# Altium project BRZ_BATT_MANAGER.PrjPcb
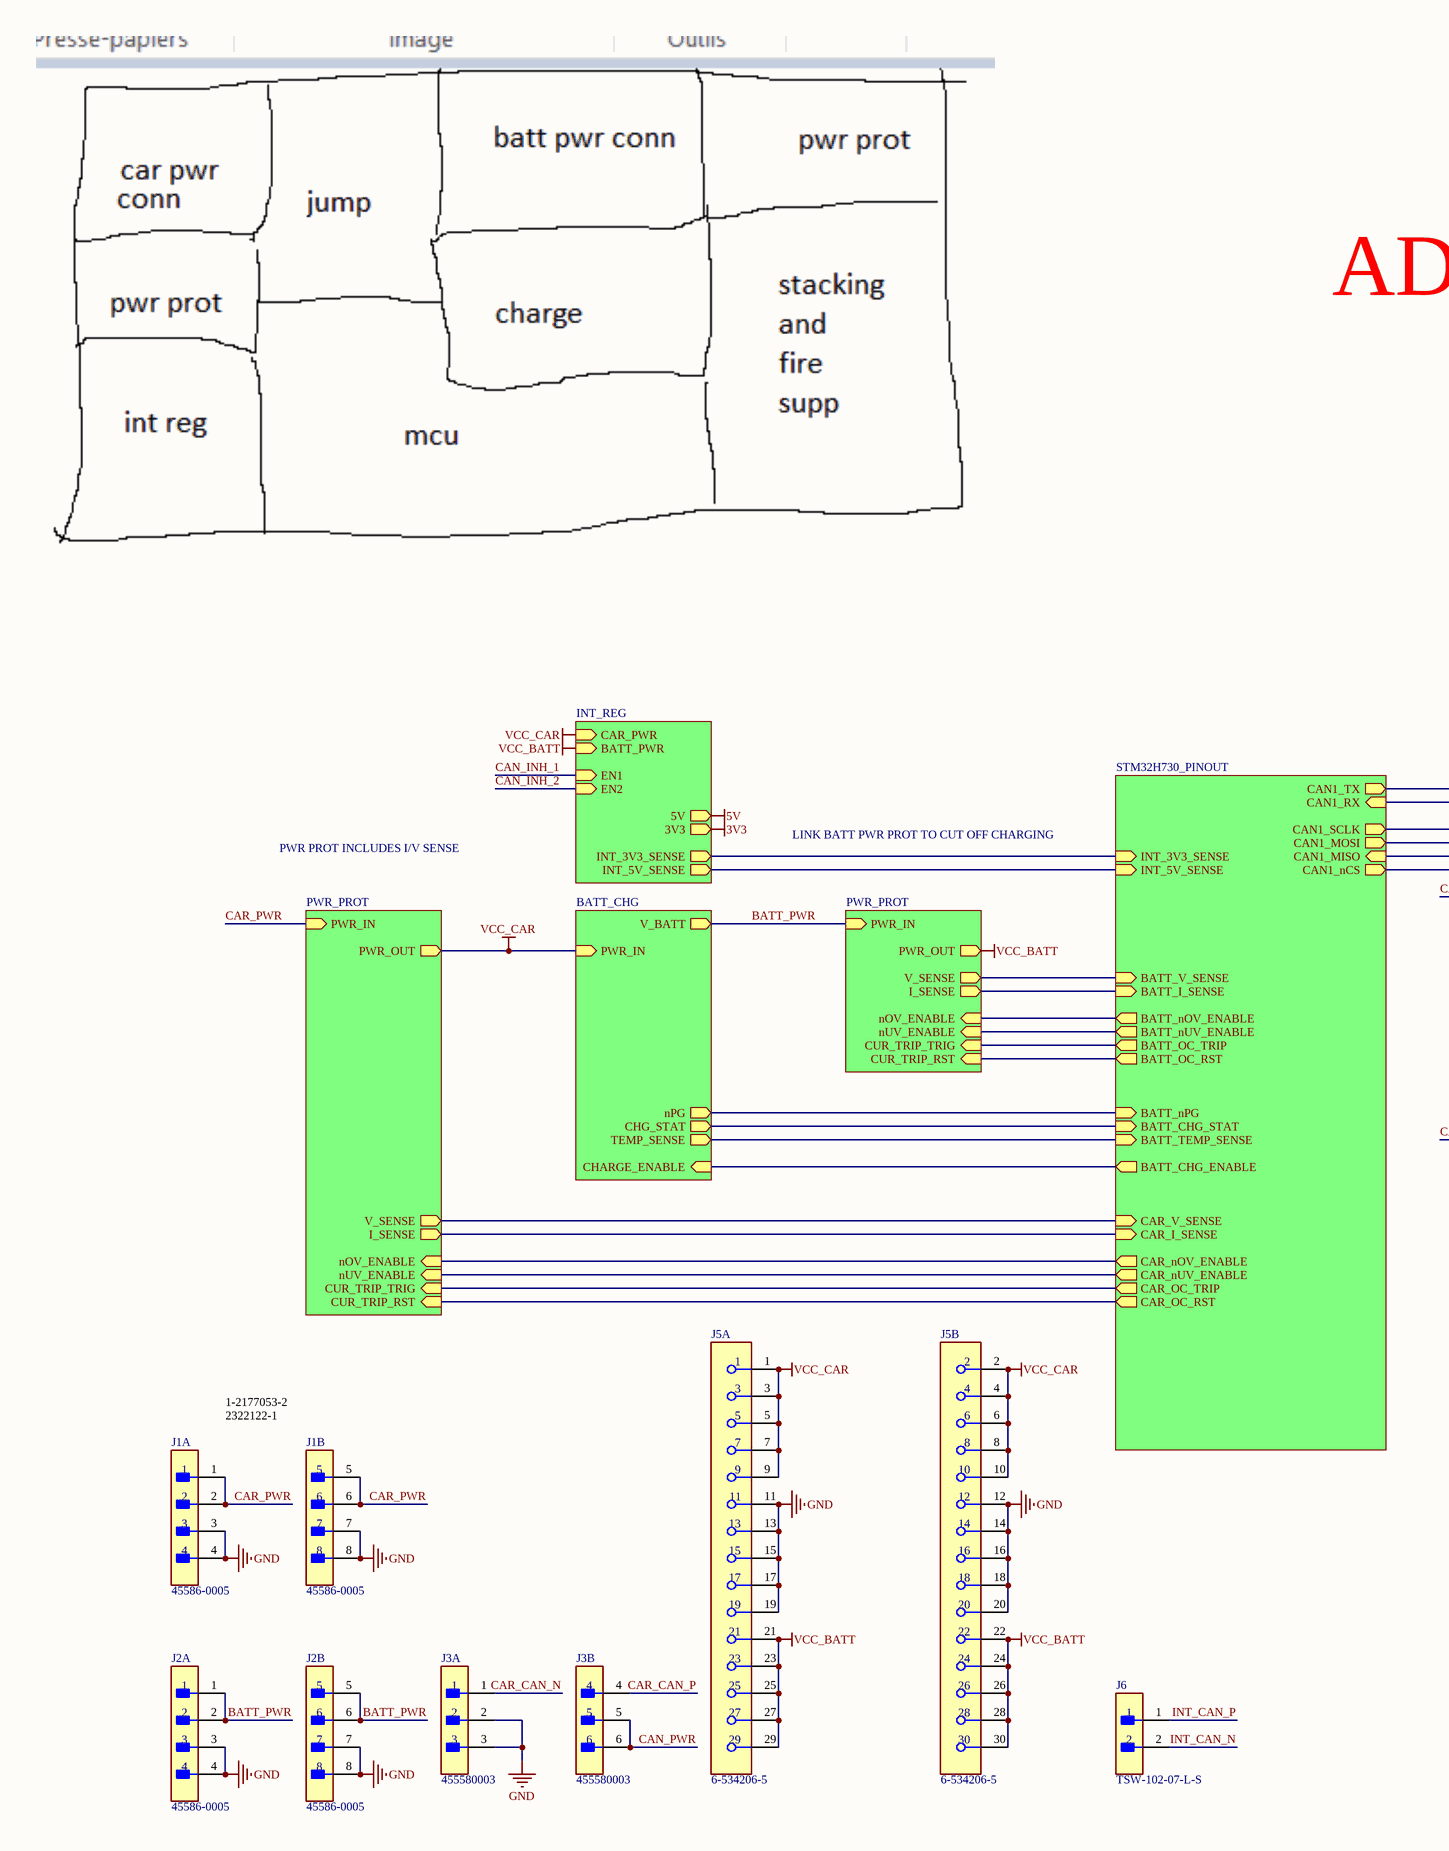
[diagram p0: BRZ_BATT_MGR.SchDoc, left]
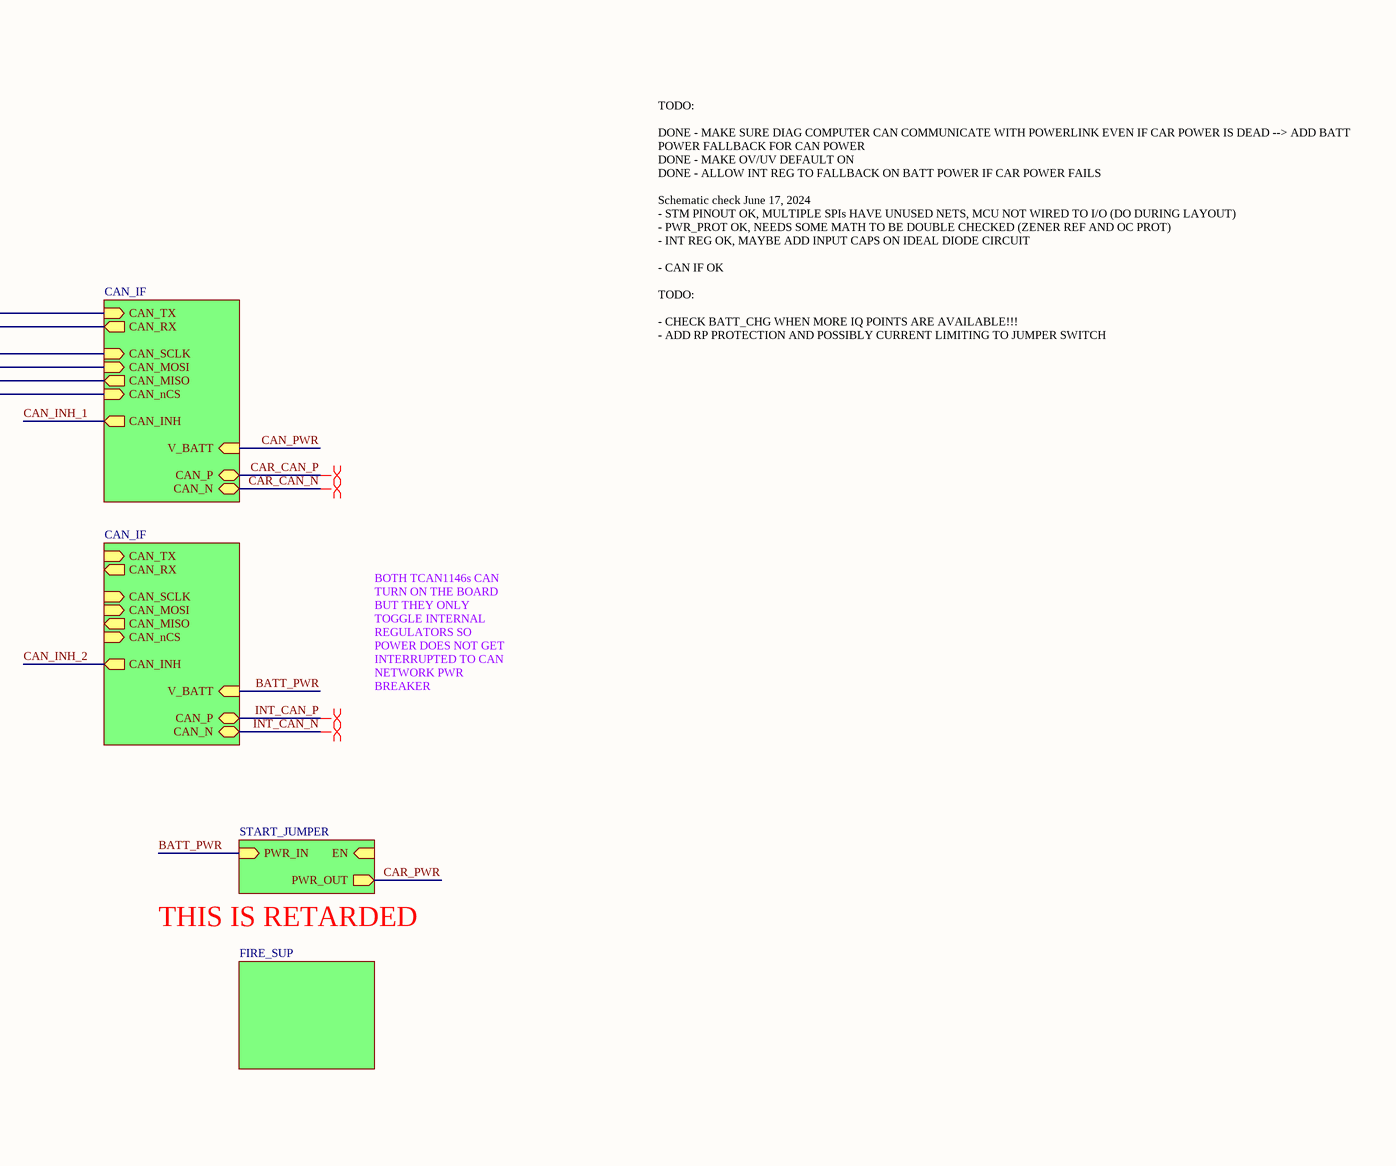
[diagram p1: BRZ_BATT_MGR.SchDoc, right]
2 sheets, 121 parts. Net scope: hierarchical (ports join the sheet entries above them; power ports are global).
Board file: BRZ_BATT_MANAGER.PcbDoc
Sheets:
  BRZ_BATT_MGR.SchDoc
    PWR_PROT_0 = PWR_PROT.SchDoc
    PWR_PROT_2 = PWR_PROT.SchDoc

## Sheet BRZ_BATT_MGR.SchDoc
size C; SheetNumber: 1; SheetTotal: 8

### Parts
J1  45586-0005  [FP-45586-0005-MFG]  (parts A,B of 2)
J2  45586-0005  [FP-45586-0005-MFG]  (parts A,B of 2)
J3  455580003  [FP-455580003-MFG]  (parts A,B of 2)
J5  6-534206-5  [FP-6-534206-5-MFG]  (parts A,B of 2)
J6  TSW-102-07-L-S  [FP-TSW-102-07-L-S-MFG]

### Sub-sheets
BATT_CHG = BATT_CHG (file not in this document): PWR_IN (in), V_BATT (out), nPG (out), CHG_STAT (out), TEMP_SENSE (out), CHARGE_ENABLE (in)
CAN_IF_0 = CAN_IF (file not in this document): CAN_TX (in), CAN_RX (out), CAN_SCLK (in), CAN_MISO (out), CAN_MOSI (in), CAN_nCS (in), V_BATT (in), CAN_INH (out), CAN_P (bidir), CAN_N (bidir)
CAN_IF_1 = CAN_IF (file not in this document): CAN_TX (in), CAN_RX (out), CAN_SCLK (in), CAN_MISO (out), CAN_MOSI (in), CAN_nCS (in), CAN_P (bidir), CAN_N (bidir), V_BATT (in), CAN_INH (out)
FIRE_SUP = FIRE_SUP (file not in this document): no entries
INT_REG = INT_REG (file not in this document): INT_3V3_SENSE (out), INT_5V_SENSE (out), 5V (out), 3V3 (out), EN1 (in), EN2 (in), CAR_PWR (in), BATT_PWR (in)
MCU = STM32H730_PINOUT (file not in this document): INT_3V3_SENSE (in), INT_5V_SENSE (in), BATT_V_SENSE (in), BATT_I_SENSE (in), BATT_nOV_ENABLE (out), BATT_nUV_ENABLE (out), BATT_OC_TRIP (out), BATT_OC_RST (out), BATT_nPG (in), BATT_CHG_STAT (in), BATT_TEMP_SENSE (in), BATT_CHG_ENABLE (out), CAR_V_SENSE (in), CAR_I_SENSE (in), CAR_nOV_ENABLE (out), CAR_nUV_ENABLE (out), CAR_OC_TRIP (out), CAR_OC_RST (out), CAN1_TX (out), CAN1_RX (in), CAN1_SCLK (out), CAN1_MOSI (out), CAN1_MISO (in), CAN1_nCS (out)
PWR_PROT_0 = PWR_PROT: PWR_OUT (out), PWR_IN (in), V_SENSE (out), I_SENSE (out), CUR_TRIP_RST (in), CUR_TRIP_TRIG (in), nOV_ENABLE (in), nUV_ENABLE (in)
PWR_PROT_2 = PWR_PROT: PWR_OUT (out), PWR_IN (in), V_SENSE (out), I_SENSE (out), CUR_TRIP_TRIG (in), CUR_TRIP_RST (in), nOV_ENABLE (in), nUV_ENABLE (in)
START_JUMPER = START_JUMPER (file not in this document): PWR_IN (in), PWR_OUT (out), EN (in)

### Nets
3V3: sheet INT_REG/3V3
5V: sheet INT_REG/5V
GND: J1.3 J1.4 J1.7 J1.8 J2.3 J2.4 J2.7 J2.8 J3.2 J3.3 J5.11 J5.12 J5.13 J5.14 J5.15 J5.16 J5.17 J5.18 J5.19 J5.20
VCC_BATT: J5.21 J5.22 J5.23 J5.24 J5.25 J5.26 J5.27 J5.28 J5.29 J5.30 ; sheet INT_REG/BATT_PWR, sheet PWR_PROT_2/PWR_OUT  [project net PWR_OUT]
VCC_CAR: J5.1 J5.2 J5.3 J5.4 J5.5 J5.6 J5.7 J5.8 J5.9 J5.10 ; sheet PWR_PROT_0/PWR_OUT, sheet INT_REG/CAR_PWR, sheet BATT_CHG/PWR_IN  [project net PWR_OUT]
BATT_PWR: J2.1 J2.2 J2.5 J2.6 ; sheet BATT_CHG/V_BATT, sheet PWR_PROT_2/PWR_IN, sheet CAN_IF_1/V_BATT, sheet START_JUMPER/PWR_IN
CAN_INH_1: sheet INT_REG/EN1, sheet CAN_IF_0/CAN_INH
CAN_INH_2: sheet INT_REG/EN2, sheet CAN_IF_1/CAN_INH
CAN_PWR: J3.5 J3.6 ; sheet CAN_IF_0/V_BATT
CAR_CAN_N: J3.1 ; sheet CAN_IF_0/CAN_N
CAR_CAN_P: J3.4 ; sheet CAN_IF_0/CAN_P
CAR_PWR: J1.1 J1.2 J1.5 J1.6 ; sheet PWR_PROT_0/PWR_IN, sheet START_JUMPER/PWR_OUT
CUR_TRIP_RST_PWR_PROT_0: sheet PWR_PROT_0/CUR_TRIP_RST, sheet MCU/CAR_OC_RST
CUR_TRIP_RST_PWR_PROT_2: sheet MCU/BATT_OC_RST, sheet PWR_PROT_2/CUR_TRIP_RST
CUR_TRIP_TRIG_PWR_PROT_0: sheet PWR_PROT_0/CUR_TRIP_TRIG, sheet MCU/CAR_OC_TRIP
CUR_TRIP_TRIG_PWR_PROT_2: sheet MCU/BATT_OC_TRIP, sheet PWR_PROT_2/CUR_TRIP_TRIG
I_SENSE_PWR_PROT_0: sheet PWR_PROT_0/I_SENSE, sheet MCU/CAR_I_SENSE
I_SENSE_PWR_PROT_2: sheet MCU/BATT_I_SENSE, sheet PWR_PROT_2/I_SENSE
INT_CAN_N: J6.2 ; sheet CAN_IF_1/CAN_N
INT_CAN_P: J6.1 ; sheet CAN_IF_1/CAN_P
V_SENSE_PWR_PROT_0: sheet PWR_PROT_0/V_SENSE, sheet MCU/CAR_V_SENSE
V_SENSE_PWR_PROT_2: sheet MCU/BATT_V_SENSE, sheet PWR_PROT_2/V_SENSE
NetR36_PWR_PROT_0_1: sheet PWR_PROT_0/nUV_ENABLE, sheet MCU/CAR_nUV_ENABLE
NetR36_PWR_PROT_2_1: sheet MCU/BATT_nUV_ENABLE, sheet PWR_PROT_2/nUV_ENABLE
NetR42_PWR_PROT_0_1: sheet PWR_PROT_0/nOV_ENABLE, sheet MCU/CAR_nOV_ENABLE
NetR42_PWR_PROT_2_1: sheet MCU/BATT_nOV_ENABLE, sheet PWR_PROT_2/nOV_ENABLE
(unnamed): sheet INT_REG/INT_3V3_SENSE, sheet MCU/INT_3V3_SENSE
(unnamed): sheet INT_REG/INT_5V_SENSE, sheet MCU/INT_5V_SENSE
(unnamed): sheet BATT_CHG/nPG, sheet MCU/BATT_nPG
(unnamed): sheet BATT_CHG/CHG_STAT, sheet MCU/BATT_CHG_STAT
(unnamed): sheet BATT_CHG/TEMP_SENSE, sheet MCU/BATT_TEMP_SENSE
(unnamed): sheet BATT_CHG/CHARGE_ENABLE, sheet MCU/BATT_CHG_ENABLE
(unnamed): sheet MCU/CAN1_TX, sheet CAN_IF_0/CAN_TX
(unnamed): sheet MCU/CAN1_RX, sheet CAN_IF_0/CAN_RX
(unnamed): sheet MCU/CAN1_SCLK, sheet CAN_IF_0/CAN_SCLK
(unnamed): sheet MCU/CAN1_MOSI, sheet CAN_IF_0/CAN_MOSI
(unnamed): sheet MCU/CAN1_MISO, sheet CAN_IF_0/CAN_MISO
(unnamed): sheet MCU/CAN1_nCS, sheet CAN_IF_0/CAN_nCS

### Layout directives
differential pair: CAR_CAN_N, CAR_CAN_P, INT_CAN_N, INT_CAN_P

### Notes on the sheet
- ADD A PDU HERE
- PWR PROT INCLUDES I/V SENSE
- LINK BATT PWR PROT TO CUT OFF CHARGING
- TODO:
  DONE - MAKE SURE DIAG COMPUTER CAN COMMUNICATE WITH POWERLINK EVEN IF CAR POWER IS DEAD --> ADD BATT POWER FALLBACK FOR CAN POWER
  DONE - MAKE OV/UV DEFAULT ON
  DONE - ALLOW INT REG TO FALLBACK ON BATT POWER IF CAR POWER FAILS
  Schematic check June 17, 2024
  - STM PINOUT OK, MULTIPLE SPIs HAVE UNUSED NETS, MCU NOT WIRED TO I/O (DO DURING LAYOUT)
  - PWR_PROT OK, NEEDS SOME MATH TO BE DOUBLE CHECKED (ZENER REF AND OC PROT)
  - INT REG OK, MAYBE ADD INPUT CAPS ON IDEAL DIODE CIRCUIT
  - CAN IF OK
  TODO:
  - CHECK BATT_CHG WHEN MORE IQ POINTS ARE AVAILABLE!!!
  - ADD RP PROTECTION AND POSSIBLY CURRENT LIMITING TO JUMPER SWITCH
- BOTH TCAN1146s CAN TURN ON THE BOARD BUT THEY ONLY TOGGLE INTERNAL REGULATORS SO POWER DOES NOT GET INTERRUPTED TO CAN NETWORK PWR BREAKER
- THIS IS RETARDED
- 1-2177053-2
  2322122-1

### Library data of the parts
J1 J2 = CMP-04776-000690-1: CONN HEADER R/A 8POS 4.2MM
J3 = CMP-04776-000024-1: CONN HEADER R/A 6POS 4.2MM; Manufacturer: Molex; Standoff Height: 0.4mm; Conn Orientation: Right Angle; Number Of Contacts: 6; Conn Gender: Male; Voltage Rating: 600V; Current Rating: 8A; Footprint Url: https://www.molex.com/pdm_docs/sd/455580003_sd.pdf; Number Of Rows: 2; Lead Free: Yes; Digikey Description: CONN HEADER R/A 6POS 4.2MM; ComponentLink2URL: https://www.molex.com/webdocs/datasheets/pdf/en-us/0455580003_PCB_HEADERS.pdf; Octopart: https://octopart.com/45558-0003-molex-7672845; Package: 0; Device Class L3: unset; ComponentLink2Description: Datasheet; Device Class L2: Headers and Wire Housings; Category: Conn; Contact Material: Tin,Nickel; Mouser Description: Conn Power HDR 6 POS 4.2mm Solder ST Thru-Hole 6 Terminal 1 Port Mini-Fit Jr™ Tray; Manufacturer Part Number: 455580003; Pitch: 4.2mm; Device Class L1: Connectors; Temperature Range Low: -40°C; Temperature: -40°C to +105°C; RoHS: TRUE; Temperature Range High: +105°C; Height: 10.38mm; Automotive: No
J5 = CMP-03369-000056-1: CONN RCPT 30POS 0.1 GOLD PCB; Manufacturer: TE; Number Of Contacts: 30; Is Female: yes; Pitch: 2.54mm; Conn Gender: Female; Standoff Height: 0.38mm; Conn Orientation: Vertical; Current Rating: 2A; Lead Free: Yes; Category: Conn; Mouser Description: Headers & Wire Housings REC 2X15P VRT T/H; Device Class L3: unset; Height: 8.9mm; ComponentLink2Description: Datasheet; Manufacturer Part Number: 6-534206-5; RoHS: TRUE; ComponentLink2URL: https://www.te.com/commerce/DocumentDelivery/DDEController?Action=showdoc&DocId=Specification+Or+Standard%7F114-25018%7FE%7Fpdf%7FEnglish%7FENG_SS_114-25018_E.pdf%7F6-534206-5; Temperature: -65°C to +105°C; Temperature Range Low: -65°C; Footprint Url: https://www.te.com/commerce/DocumentDelivery/DDEController?Action=showdoc&DocId=Customer+Drawing%7F534206%7FR7%7Fpdf%7FEnglish%7FENG_CD_534206_R7.pdf%7F6-534206-5; Contact Material: Gold,Nickel; Automotive: No; Package: 0; Device Class L2: Headers and Wire Housings; Device Class L1: Connectors; Temperature Range High: +105°C; Number Of Rows: 2; Digikey Description: CONN RCPT 30POS 0.1 GOLD PCB; Octopart: https://octopart.com/6-534206-5-te+connectivity-39516817
J6 = CMP-02766-001428-1: CONN HEADER VERT 2POS 2.54MM; Voltage Rating: 550V; Current Rating: 7.6A; Gender: Male; Number of Contacts: 2; Connector Type: Male Pin; Radiation Hardening: No; Orientation: Straight; Contact Plating: Gold; Max Operating Temperature: 125°C; Mount: Through Hole; Package Quantity: 1; Number of Rows: 1; Housing Material: Polyester; RoHS Compliant: Yes; Length: 5.08mm; Max Voltage Rating (AC): 550V; Pitch: 2.54mm; Packaging: Bulk; Depth: 2.54mm; Termination: Solder; Min Operating Temperature: -55°C; Housing Color: Black; Lead Free: Lead Free; Color: Black; Number of Positions: 2; Width: 2.54mm; Max Current Rating: 7.6A; REACH SVHC: No SVHC; Contact Material: Bronze; Contact Mating Length: 0.23inch; Series: TSW; Contact Type: Male Pin

## Sheet PWR_PROT.SchDoc
size C; SheetNumber: 3; SheetTotal: 8
Used 2 times, as channels PWR_PROT_0, PWR_PROT_2. Parts and nets are listed once, with the designators drawn on the sheet.
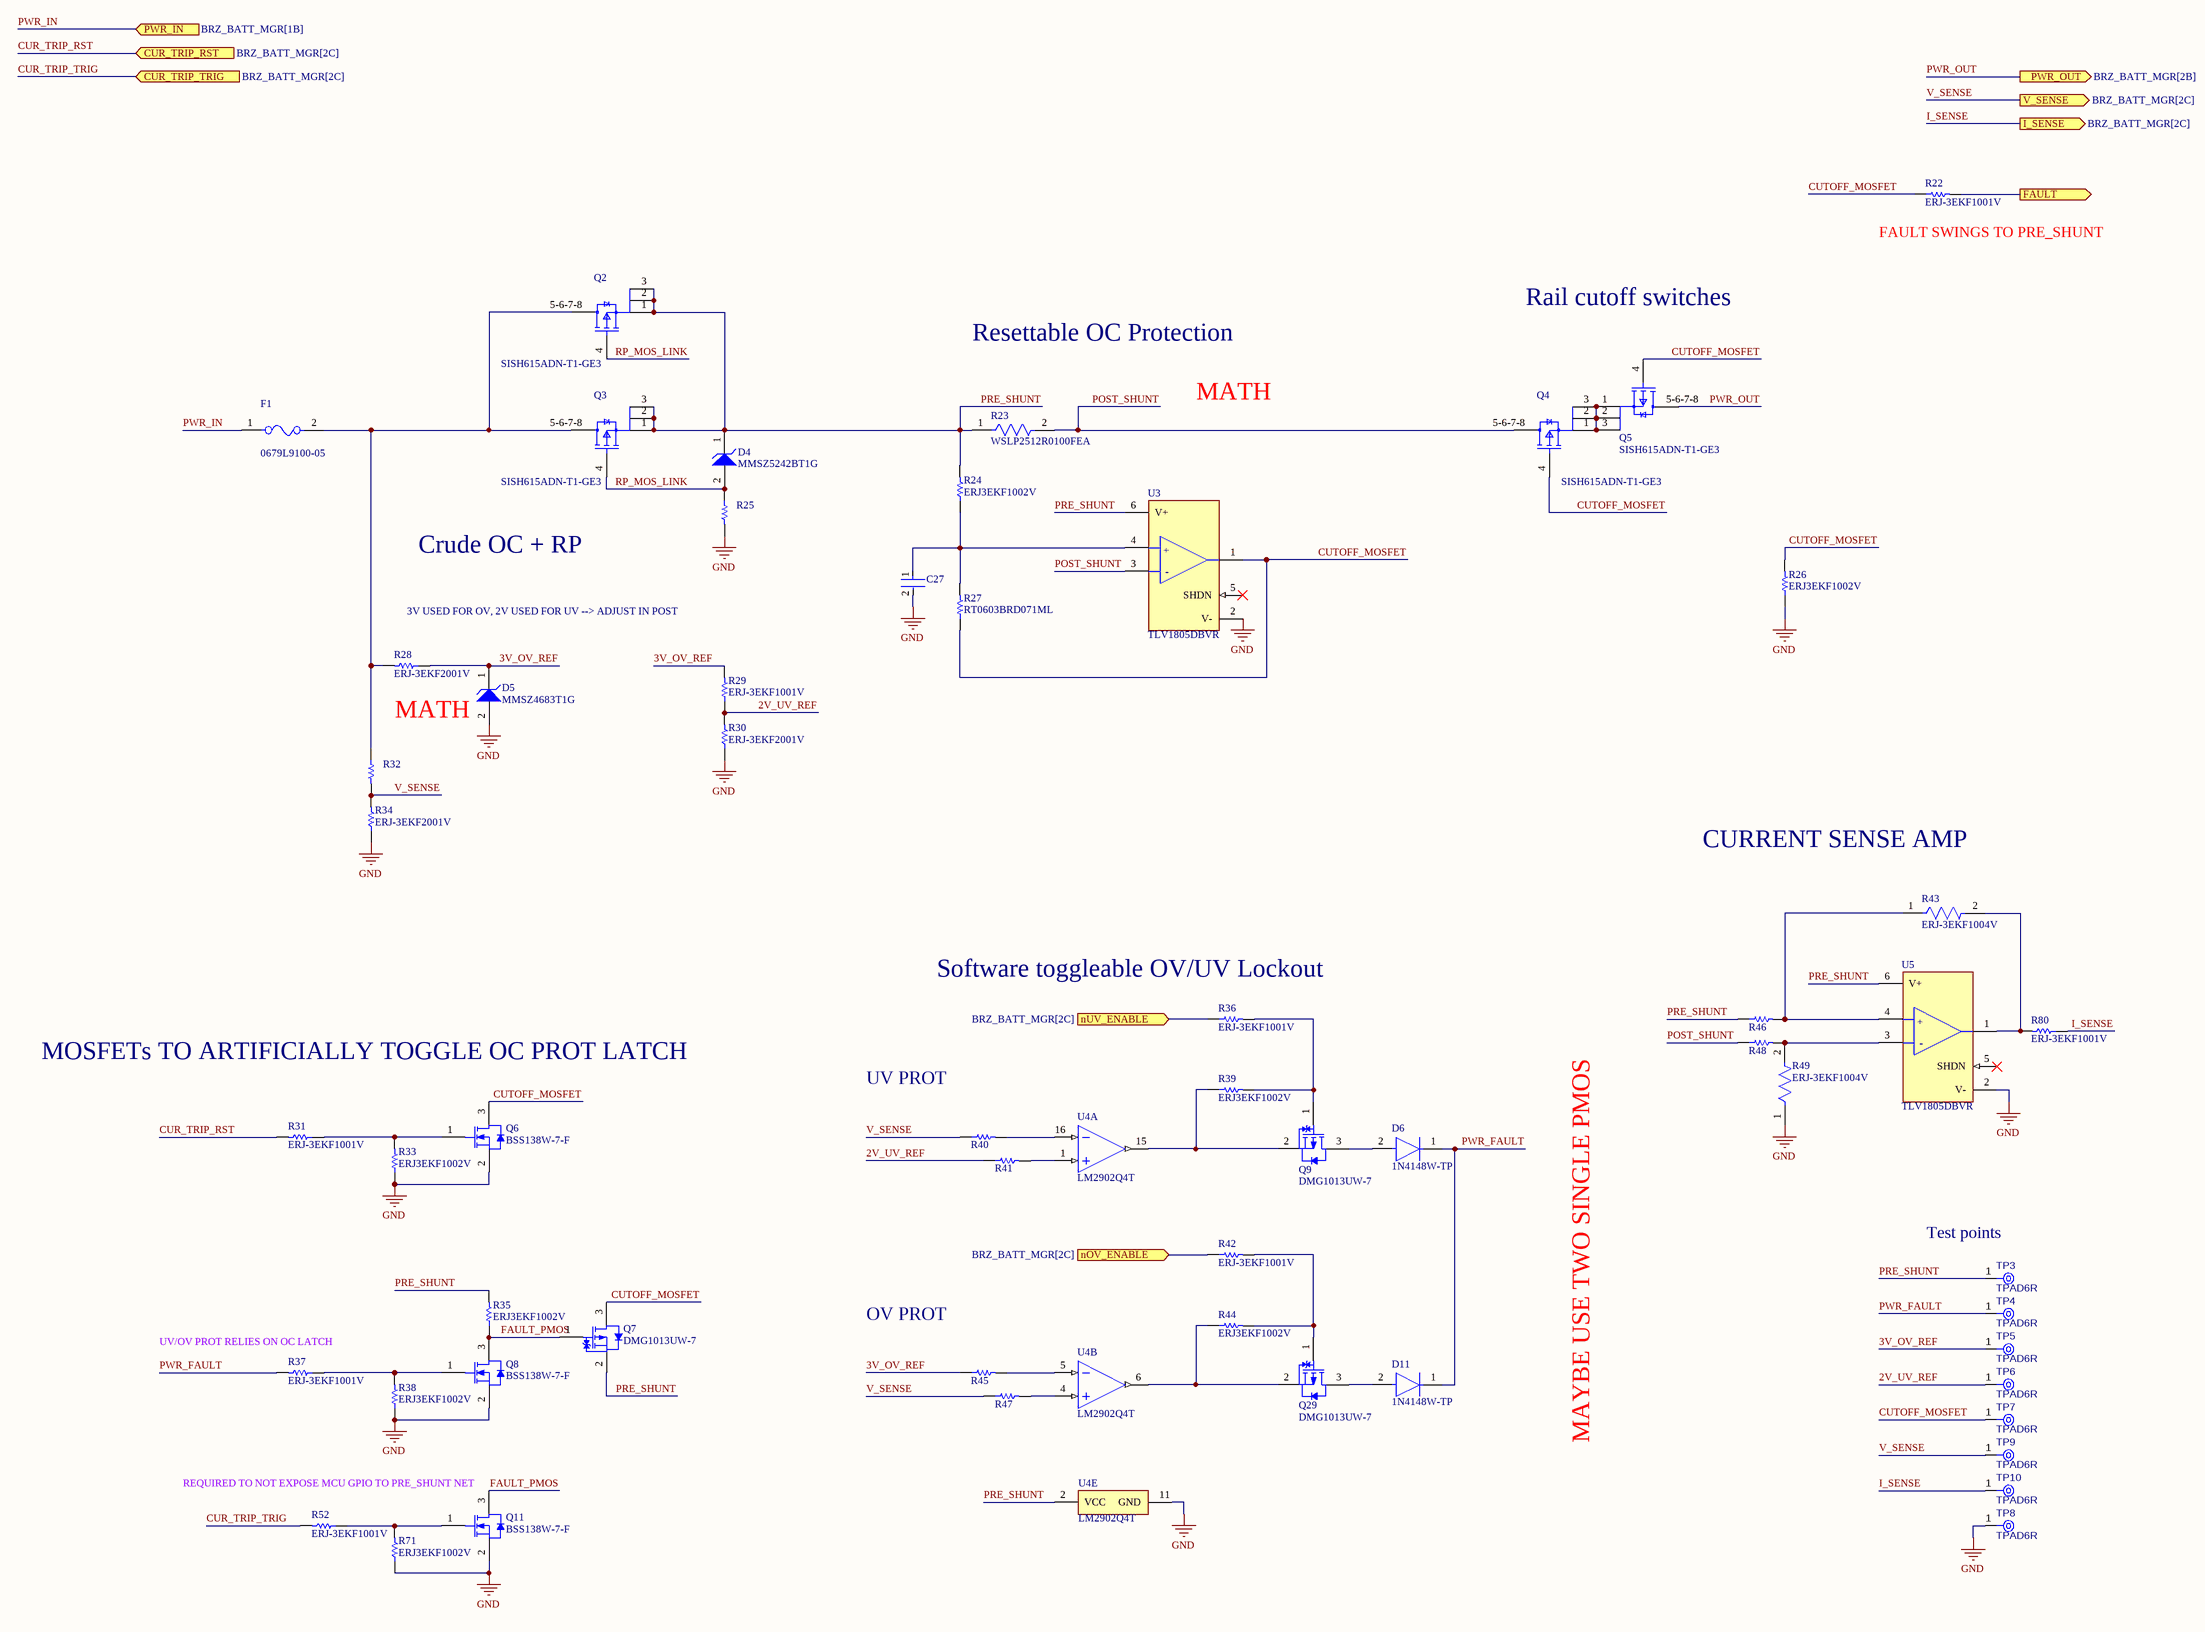
[diagram p2: PWR_PROT.SchDoc]

### Parts
C27  GRM188R71H104KA93D  [FP-0402-L_1_0_0_05-W_0_5-IPC_A]  (value not drawn)
D4  MMSZ5242BT1G  [ONSC-SOD-123-2-425-04_V]
D5  MMSZ4683T1G  [ONSC-SOD-123-2-425-04_V]
D6  1N4148W-TP  [FP-SOD-123-IPC_A]
D11  1N4148W-TP  [FP-SOD-123-IPC_A]
F1  0679L9100-05  [FP-0679L-MFG]
Q2  SISH615ADN-T1-GE3  [SISH615ADN-T1-GE3-Footprint-1]
Q3  SISH615ADN-T1-GE3  [SISH615ADN-T1-GE3-Footprint-1]
Q4  SISH615ADN-T1-GE3  [SISH615ADN-T1-GE3-Footprint-1]
Q5  SISH615ADN-T1-GE3  [SISH615ADN-T1-GE3-Footprint-1]
Q6  BSS138W-7-F  [DIOD-SOT323-3_V]
Q7  DMG1013UW-7  [DIOD-SOT323-3_V]
Q8  BSS138W-7-F  [DIOD-SOT323-3_V]
Q9  DMG1013UW-7  [DIOD-SOT323-3_V]
Q11  BSS138W-7-F  [DIOD-SOT323-3_V]
Q29  DMG1013UW-7  [DIOD-SOT323-3_V]
R22  ERJ-3EKF1001V  [RESC1608X55X30LL15T15]
R23  WSLP2512R0100FEA  [FP-WSLP2512R0100FEA-MFG]
R24  ERJ3EKF1002V  [RESC1609X55X30LL15T15]
R25  ERJ3EKF1002V  [RESC1609X55X30LL15T15]  (value not drawn)
R26  ERJ3EKF1002V  [RESC1609X55X30LL15T15]
R27  RT0603BRD071ML  [RESC1608X55X30NL20T20]
R28  ERJ-3EKF2001V  [RESC1608X55X30ML15T15]
R29  ERJ-3EKF1001V  [RESC1608X55X30LL15T15]
R30  ERJ-3EKF2001V  [RESC1608X55X30ML15T15]
R31  ERJ-3EKF1001V  [RESC1608X55X30LL15T15]
R32  ERJ3EKF1002V  [RESC1609X55X30LL15T15]  (value not drawn)
R33  ERJ3EKF1002V  [RESC1609X55X30LL15T15]
R34  ERJ-3EKF2001V  [RESC1608X55X30ML15T15]
R35  ERJ3EKF1002V  [RESC1609X55X30LL15T15]
R36  ERJ-3EKF1001V  [RESC1608X55X30LL15T15]
R37  ERJ-3EKF1001V  [RESC1608X55X30LL15T15]
R38  ERJ3EKF1002V  [RESC1609X55X30LL15T15]
R39  ERJ3EKF1002V  [RESC1609X55X30LL15T15]
R40  ERJ3EKF1002V  [RESC1609X55X30LL15T15]  (value not drawn)
R41  ERJ3EKF1002V  [RESC1609X55X30LL15T15]  (value not drawn)
R42  ERJ-3EKF1001V  [RESC1608X55X30LL15T15]
R43  ERJ-3EKF1004V  [FP-ERJ3EK-IPC_C]
R44  ERJ3EKF1002V  [RESC1609X55X30LL15T15]
R45  ERJ3EKF1002V  [RESC1609X55X30LL15T15]  (value not drawn)
R46  ERJ3EKF1002V  [RESC1609X55X30LL15T15]  (value not drawn)
R47  ERJ3EKF1002V  [RESC1609X55X30LL15T15]  (value not drawn)
R48  ERJ3EKF1002V  [RESC1609X55X30LL15T15]  (value not drawn)
R49  ERJ-3EKF1004V  [FP-ERJ3EK-IPC_C]
R52  ERJ-3EKF1001V  [RESC1608X55X30LL15T15]
R71  ERJ3EKF1002V  [RESC1609X55X30LL15T15]
R80  ERJ-3EKF1001V  [RESC1608X55X30LL15T15]
TP3  TPAD6R  [TP06R]  (no BOM)
TP4  TPAD6R  [TP06R]  (no BOM)
TP5  TPAD6R  [TP06R]  (no BOM)
TP6  TPAD6R  [TP06R]  (no BOM)
TP7  TPAD6R  [TP06R]  (no BOM)
TP8  TPAD6R  [TP06R]  (no BOM)
TP9  TPAD6R  [TP06R]  (no BOM)
TP10  TPAD6R  [TP06R]  (no BOM)
U3  TLV1805DBVR  [FP-DBV0006A-IPC_C]
U4  LM2902Q4T  [LM2902Q4T-Footprint-1]  (parts A,B,E of 5)
U5  TLV1805DBVR  [FP-DBV0006A-IPC_C]

### Ports
CUR_TRIP_RST (in, see BRZ_BATT_MGR[2C]), CUR_TRIP_TRIG (in, see BRZ_BATT_MGR[2C]), FAULT (out), I_SENSE (out, see BRZ_BATT_MGR[2C]), nOV_ENABLE (in, see BRZ_BATT_MGR[2C]), nUV_ENABLE (in, see BRZ_BATT_MGR[2C]), PWR_IN (in, see BRZ_BATT_MGR[1B]), PWR_OUT (out, see BRZ_BATT_MGR[2B]), V_SENSE (out, see BRZ_BATT_MGR[2C])

### Nets
GND: C27.2 D5.2(A) Q6.2(S) Q8.2(S) Q11.2(S) R25.2 R26.1 R30.1 R33.1 R34.1 R38.1 R49.1 R71.1 TP8.1(TP) U3.2(V-) U4.11(GND) U5.2(V-)
2V_UV_REF: R29.1 R30.2 R41.1 TP6.1(TP)
3V_OV_REF: D5.1(K) R28.1 R29.2 R45.1 TP5.1(TP)
CUR_TRIP_RST: R31.2 ; port CUR_TRIP_RST
CUR_TRIP_TRIG: R52.2 ; port CUR_TRIP_TRIG
CUTOFF_MOSFET: Q4.4(G) Q5.4(G) Q6.3(D) Q7.3(D) R22.1 R26.2 R27.1 TP7.1(TP) U3.1(OUT)
FAULT: R22.2 ; port FAULT
FAULT_PMOS: Q7.1(G) Q8.3(D) Q11.3(D) R35.1
I_SENSE: R80.1 TP10.1(TP) ; port I_SENSE
nOV_ENABLE: R42.1 ; port nOV_ENABLE
nUV_ENABLE: R36.1 ; port nUV_ENABLE
POST_SHUNT: Q4.5-6-7-8(D) R23.2 R48.1 U3.3(-IN)
PRE_SHUNT: D4.1(K) Q2.1(S) Q2.2(S) Q2.3(S) Q3.1(S) Q3.2(S) Q3.3(S) Q7.2(S) R23.1 R24.2 R35.2 R46.1 TP3.1(TP) U3.6(V+) U4.2(VCC) U5.6(V+)
PWR_FAULT: D6.1(C) D11.1(C) R37.2 TP4.1(TP)
PWR_IN: F1.1 ; port PWR_IN
PWR_OUT: Q5.5-6-7-8(D) ; port PWR_OUT
RP_MOS_LINK: D4.2(A) Q2.4(G) Q3.4(G) R25.1
V_SENSE: R32.2 R34.2 R40.1 R47.1 TP9.1(TP) ; port V_SENSE
NetC27_1: C27.1 R24.1 R27.2 U3.4(+IN)
NetD6_2: D6.2(A) Q9.3(D)
NetD11_2: D11.2(A) Q29.3(D)
NetF1_2: F1.2 Q2.5-6-7-8(D) Q3.5-6-7-8(D) R28.2 R32.1
NetQ4_1: Q4.1(S) Q4.2(S) Q4.3(S) Q5.1(S) Q5.2(S) Q5.3(S)
NetQ6_1: Q6.1(G) R31.1 R33.2
NetQ8_1: Q8.1(G) R37.1 R38.2
NetQ9_1: Q9.1(G) R36.2 R39.2
NetQ9_2: Q9.2(S) R39.1 U4.15(1OUT)
NetQ11_1: Q11.1(G) R52.1 R71.2
NetQ29_1: Q29.1(G) R42.2 R44.2
NetQ29_2: Q29.2(S) R44.1 U4.6(2OUT)
NetR40_2: R40.2 U4.16(1IN-)
NetR41_2: R41.2 U4.1(1IN+)
NetR43_1: R43.1 R46.2 U5.4(+IN)
NetR43_2: R43.2 R80.2 U5.1(OUT)
NetR45_2: R45.2 U4.5(2IN-)
NetR47_2: R47.2 U4.4(2IN+)
NetR48_2: R48.2 R49.2 U5.3(-IN)

Not connected (* = marked no-connect by the designer): U3 5(SHDN)*; U5 5(SHDN)*

### Channels
PWR_PROT_0: designators end in _PWR_PROT_0; ports CUR_TRIP_RST=CUR_TRIP_RST_PWR_PROT_0 CUR_TRIP_TRIG=CUR_TRIP_TRIG_PWR_PROT_0 FAULT=NetR22_PWR_PROT_0_2 I_SENSE=I_SENSE_PWR_PROT_0 nOV_ENABLE=NetR42_PWR_PROT_0_1 nUV_ENABLE=NetR36_PWR_PROT_0_1 PWR_IN=CAR_PWR PWR_OUT=PWR_OUT V_SENSE=V_SENSE_PWR_PROT_0
PWR_PROT_2: designators end in _PWR_PROT_2; ports CUR_TRIP_RST=CUR_TRIP_RST_PWR_PROT_2 CUR_TRIP_TRIG=CUR_TRIP_TRIG_PWR_PROT_2 FAULT=NetR22_PWR_PROT_2_2 I_SENSE=I_SENSE_PWR_PROT_2 nOV_ENABLE=NetR42_PWR_PROT_2_1 nUV_ENABLE=NetR36_PWR_PROT_2_1 PWR_IN=BATT_PWR PWR_OUT=PWR_OUT V_SENSE=V_SENSE_PWR_PROT_2

### Notes on the sheet
- (near R22) FAULT SWINGS TO PRE_SHUNT
- Rail cutoff switches
- Resettable OC Protection
- MATH
- Crude OC + RP
- 3V USED FOR OV, 2V USED FOR UV --> ADJUST IN POST
- CURRENT SENSE AMP
- (near R36) Software toggleable OV/UV Lockout
- MOSFETs TO ARTIFICIALLY TOGGLE OC PROT LATCH
- UV PROT
- (near TP3) Test points
- OV PROT
- (near R37) UV/OV PROT RELIES ON OC LATCH
- MAYBE USE TWO SINGLE PMOS
- REQUIRED TO NOT EXPOSE MCU GPIO TO PRE_SHUNT NET
- (in symbol CMP-04896-000098-1) +; -

### Library data of the parts
C27 = CMP-001-00058-1: LARGE PADS, 0402 CAP, CHANGE COMMENT TO MATCH REAL P/N; Capacitor Type: Ceramic; Min Operating Temperature: -55°C; Mounting Technology: Surface Mount; Pins: 2; Case/Package: 0402; RoHS Compliant: Yes; Max Operating Temperature: 85°C
D4 = CMP-1060-00565-1: Zener Voltage Regulator, 500 mW, 2-Pin SOD-123, Pb-Free, Tape and Reel; Manufacturer: On Semiconductor; P Max (W): 0.5; VZ Typ (V): 12; PartNumber: MMSZ5242BT1G; PackageReference: SOD-123-2-425-04; ComponentLink3URL: http://www.onsemi.com/pub_link/Collateral/425-04.PDF; Mounting Technology: Surface Mount; ComponentLink2Description: Datasheet; ComponentLink1URL: http://www.onsemi.com/; ComponentLink3Description: Package Specification; PackageDescription: 2-Pin SOD, Body 1.6 x 2.69 mm; PackageVersion: Rev. G, 10/2009; ComponentLink1Description: Manufacturer URL; RoHS: Pb-Free; ComponentLink2URL: http://www.onsemi.com/pub_link/Collateral/MMSZ5221BT1-D.PDF; Packing: Tape and Reel; DatasheetVersion: Rev. 12
D5 = CMP-1060-00600-1: Zener Voltage Regulator, 500 mW, 2-Pin SOD-123, Pb-Free, Tape and Reel; Manufacturer: On Semiconductor; P Max (W): 0.5; VZ Typ (V): 3; ComponentLink2Description: Datasheet; ComponentLink3URL: http://www.onsemi.com/pub_link/Collateral/425-04.PDF; PackageVersion: Rev. G, 10/2009; RoHS: Pb-Free; ComponentLink2URL: http://www.onsemi.com/pub_link/Collateral/MMSZ4678T1-D.PDF; DatasheetVersion: Rev. 9; PackageDescription: 2-Pin SOD, Body 1.6 x 2.69 mm; PartNumber: MMSZ4683T1G; ComponentLink3Description: Package Specification; ComponentLink1URL: http://www.onsemi.com/; ComponentLink1Description: Manufacturer URL; Packing: Tape and Reel; PackageReference: SOD-123-2-425-04; Mounting Technology: Surface Mount
D6 D11 = CMP-2000-04993-2: DIODE GEN PURP 100V 150MA SOD123; Max Reverse Leakage Current: 5uA; Max Surge Current: 2A; Reverse Recovery Time: 4ns; Polarity: Standard; Capacitance: 4pF; Max Forward Surge Current (Ifsm): 1A; Element Configuration: Single; Power Dissipation: 400mW; Forward Voltage: 1V; Radiation Hardening: No; Lead Free: Lead Free; Max Reverse Voltage (DC): 100V; Current Rating: 150mA; Forward Current: 150mA; Packaging: Tape and Reel; Number of Pins: 2; Package Quantity: 3000; Max Operating Temperature: 150°C; Min Operating Temperature: -65°C; Average Rectified Current: 150mA; Recovery Time: 4ns; Output Current: 150mA; Peak Non-Repetitive Surge Current: 2A; Width: 1.8mm; Voltage Rating (DC): 100V; Height: 1.2mm; Max Repetitive Reverse Voltage (Vrrm): 100V; Mount: Surface Mount; Length: 2.85mm
F1 = CMP-16042-000002-1: DIFF P#!!! / FUSE BRD MNT 10A 125VAC/VDC; Manufacturer: Bel Fuse; Manufacturer Part Number: 0679L9150-01; Max Fuse Ac Voltage: 125V; Fuse Blow Speed: Fast; Fuse Current: 15A; Fuse I2T: 103.5A2Sec; Fuse Interrupt Ac Current: 50A; Automotive Grade: Grade 1; Value: 0.0038Ω; Fuse Interrupt Dc Current: 300A; Fuse Voltage Drop: 0.13V; Device Class L2: Fuses; ComponentLink2URL: https://www.belfuse.com/resources/CircuitProtection/datasheets/0679L%20Sep2016.pdf; Package: 0679L; Height: 2.79mm; Digikey Description: FUSE BRD MNT 15A 125VAC/VDC; Temperature Range High: +125°C; Device Class L3: unset; Octopart: https://octopart.com/0679l9150-01-bel+fuse-70850665; Temperature Range Low: -55°C; Max Fuse Dc Voltage: 125V; Ipc Land Pattern Name: CAPC610254X254; Category: Fuse; Lead Free: Yes; Automotive: Yes; Resistance: 0.0038Ω; RoHS: TRUE; Device Class L1: Circuit Protection; ComponentLink2Description: Datasheet; Temperature: -55°C to +125°C; Voltage Rating: 125V
Q2 Q3 = CMP-013-00036-2: Trans MOSFET P-CH 20V 22.1A 8-Pin PowerPAK 1212 EP T/R
Q4 Q5 = CMP-013-00036-1: Trans MOSFET P-CH 20V 22.1A 8-Pin PowerPAK 1212 EP T/R
Q6 Q8 Q11 = CMP-2000-05968-1: N-Channel Enhancement Mode Mosfet, 50 V, 200 mA, -55 to 150 degC, 6-Pin SOT-323, RoHS, Tape and Reel; Typical Turn-Off Delay Time: 20ns; Number of Channels: 1Channel; Type: EnhancementModeFieldEffectTransistor; Brand: DiodesIncorporated; Vds - Drain-Source Breakdown Voltage: 75V; Vgs - Gate-Source Voltage: 20V; Rds On - Drain-Source Resistance: 1.4Ohms; Transistor Type: 1N-Channel; Configuration: Single; Unit Weight: 0.000212oz; Pd - Power Dissipation: 200mW; Id - Continuous Drain Current: 200mA; Forward Transconductance - Min: 0.1S; Manufacturer URL: http://www.diodes.com/; Series: BSS138; Package Description: 3-Pin Small Outline Transistor, Body 2 x 1.25 mm, Pitch 0.65 mm; Mounting Technology: SurfaceMount; Product Category: MOSFET; RoHS: True; Maximum Operating Temperature: +150C; Height: 1mm; Length: 2.2mm; Technology: Si; Width: 1.35mm; Datasheet URL: http://www.diodes.com/_files/datasheets/ds30206.pdf; Manufacturer: DiodesIncorporated; Package / Case: SOT-323-3; Typical Turn-On Delay Time: 20ns; Transistor Polarity: N-Channel; Factory Pack Quantity: 3000; Packaging: Reel; Product: MOSFETSmallSignal; Datasheet Version: Rev. 11-2, 09/2013; Package Reference: SOT323; Minimum Operating Temperature: -55C; Mounting Style: SMD/SMT; Channel Mode: Enhancement
Q7 Q9 Q29 = CMP-2000-06170-1: P-Channel Enhancement Mode MOSFET, 310 mW, 20 V, -55 to 150 degC, 3-Pin SOT-323, RoHS, Tape and Reel; Manufacturer: Diodes Inc; Qg Gate Charge: 0.622nC; Drain-Source On Resistance-Max: 750mO; Rated Power Dissipation: 310mW; Drain-to-Source Voltage [Vdss]: 20V; Package Reference: SOT323; Datasheet Version: Rev. 3-2, 09/2013; Package Description: 3-Pin Small Outline Transistor, Body 2 x 1.25 mm, Pitch 0.65 mm; Mounting Technology: SurfaceMount; Manufacturer URL: http://www.diodes.com/; Datasheet URL: http://www.diodes.com/_files/datasheets/ds31861.pdf; Channel Type: P-Channel
R22 R29 R31 R36 R37 R42 R52 R80 = CMP-2000-00180-1: Manufacturer: Panasonic; Part Number: ERJ-3EKF1001V
R23 = CMP-02407-010954-1: RES 0.01 OHM 1% 3W 2512; Resistance: 10mR; Temperature Coefficient: 75ppm/°C; Max Operating Temperature: 170°C; Tolerance: 1%; Resistance Tolerance: 1%; Series: WSLP; Lead Free: Lead Free; RoHS Compliant: Yes; Case Code (Imperial): 2512; Packaging: Tape and Reel; Length: 6.4mm; Height: 0.635mm; Package Quantity: 2000; Case Code (Metric): 6432; Case/Package: 2512; Power Rating: 3W; Min Operating Temperature: -65°C; Termination: SMD/SMT; Weight: 0.001429oz; Width: 3.2mm; Resistor Type: Metal Strip
R24-R26 R32 R33 R35 R38-R41 R44-R48 R71 = CMP-1012-00623-3: Chip Resistor, 10 KOhm, +/- 1%, 0.1 W, -55 to 155 degC, 0603 (1608 Metric), RoHS, Tape and Reel; Manufacturer: Panasonic; Voltage Rating: 75V; Case\/Package: 0603; Power Rating: 100mW; Resistance: 10KOhm; Temperature Coefficient: 100ppm\/degreesC; Number of Pins: 2; Package Reference: 603; Depth: 0.8mm; Mount: SurfaceMount; Package Description: 2-Pin Surface Mount Device, Body 1.6 x 0.85 mm; Datasheet Version: 02/2017; Length: 1.6mm; Lead Free: LeadFree; Height: 0.45mm; Number of Terminations: 2; Max Power Dissipation: 100mW; Min Operating Temperature: -55degC; Datasheet URL: https://industrial.panasonic.com/cdbs/www-data/pdf/RDA0000/AOA0000C304.pdf; Termination: SMD/SMT; Case Code (Metric): 1608; Case Code (Imperial): 0603; Tolerance: 1%; Max Operating Temperature: 155degC; RoHSCompliant: true; Voltage Rating (DC): 75V; Radiation Hardening: No; Packaging: TapeandReel; Composition: ThickFilm; Mounting Technology: SurfaceMount; Manufacturer URL: http://www.panasonic.com/; Width: 0.031inch; REACH SVHC: NoSVHC; Contact Plating: Tin; Military Standard: Not; Package Quantity: 1
R27 = CMP-2000-00925-1: NOT PANASONIC, THIS IS A 1M RESISTORhttps://www.yageo.com/upload/media/product/productsearch/datasheet/rchip/PYu-RT_1-to-0.01_RoHS_L_13.pdf; Part Number: ERA-3AEB163V; Manufacturer: Panasonic
R28 R30 R34 = CMP-2000-00317-1: Manufacturer: Panasonic; Part Number: ERJ-3EKF2001V
R43 R49 = CMP-1012-00849-3: RES SMD 1M OHM 1% 1/10W 0603; Resistance: 1MR; Voltage Rating: 75V; Temperature Coefficient: 100ppm/°C; Power Rating: 100mW; REACH SVHC: No SVHC; Radiation Hardening: No; Features: Automotive AEC-Q200; Case Code (Metric): 1608; Resistance Tolerance: 1%; Case/Package: 0603; Termination: SMD/SMT; Max Operating Temperature: 155°C; Tolerance: 1%; Size Code: 0603; Case Code (Imperial): 0603; Min Operating Temperature: -55°C; Number of Pins: 2; Mount: Surface Mount; Package Quantity: 1; Military Standard: Not; Voltage Rating (DC): 75V; Depth: 0.8mm; Packaging: Tape and Reel; Width: 0.8mm; Number of Terminations: 2; Length: 1.6mm; Height: 0.022inch; RoHS Compliant: Yes; Resistor Type: Thick Film; Contact Plating: Tin; Lead Free: Lead Free; Series: ERJ; Construction: Rectangular; Max Power Dissipation: 100mW
TP3-TP10 = CMP-00028-00002-2: 0.6mm round; Pins: 1
U3 U5 = CMP-04896-000098-1: 40V, RAIL-TO-RAIL INPUT, PUSH-PU
U4 = CMP-014-00004-1: LM2902 Series 30 V 1.3 MHz Low-Power Quad Operational Amplifier - QFN-16 (3x3)

## Nets that join several sheets
GND: BRZ_BATT_MGR (20 pins), PWR_PROT_0 (17 pins), PWR_PROT_2 (17 pins)
PWR_OUT: BRZ_BATT_MGR (10 pins), PWR_PROT_0 (Q5_PWR_PROT_0.5-6-7-8)
PWR_OUT: BRZ_BATT_MGR (10 pins), PWR_PROT_2 (Q5_PWR_PROT_2.5-6-7-8)
BATT_PWR: BRZ_BATT_MGR (J2.1 J2.2 J2.5 J2.6), PWR_PROT_2 (F1_PWR_PROT_2.1)
CAR_PWR: BRZ_BATT_MGR (J1.1 J1.2 J1.5 J1.6), PWR_PROT_0 (F1_PWR_PROT_0.1)